# EAGLE schematic robotrev2 (EAGLE 7.1.0)
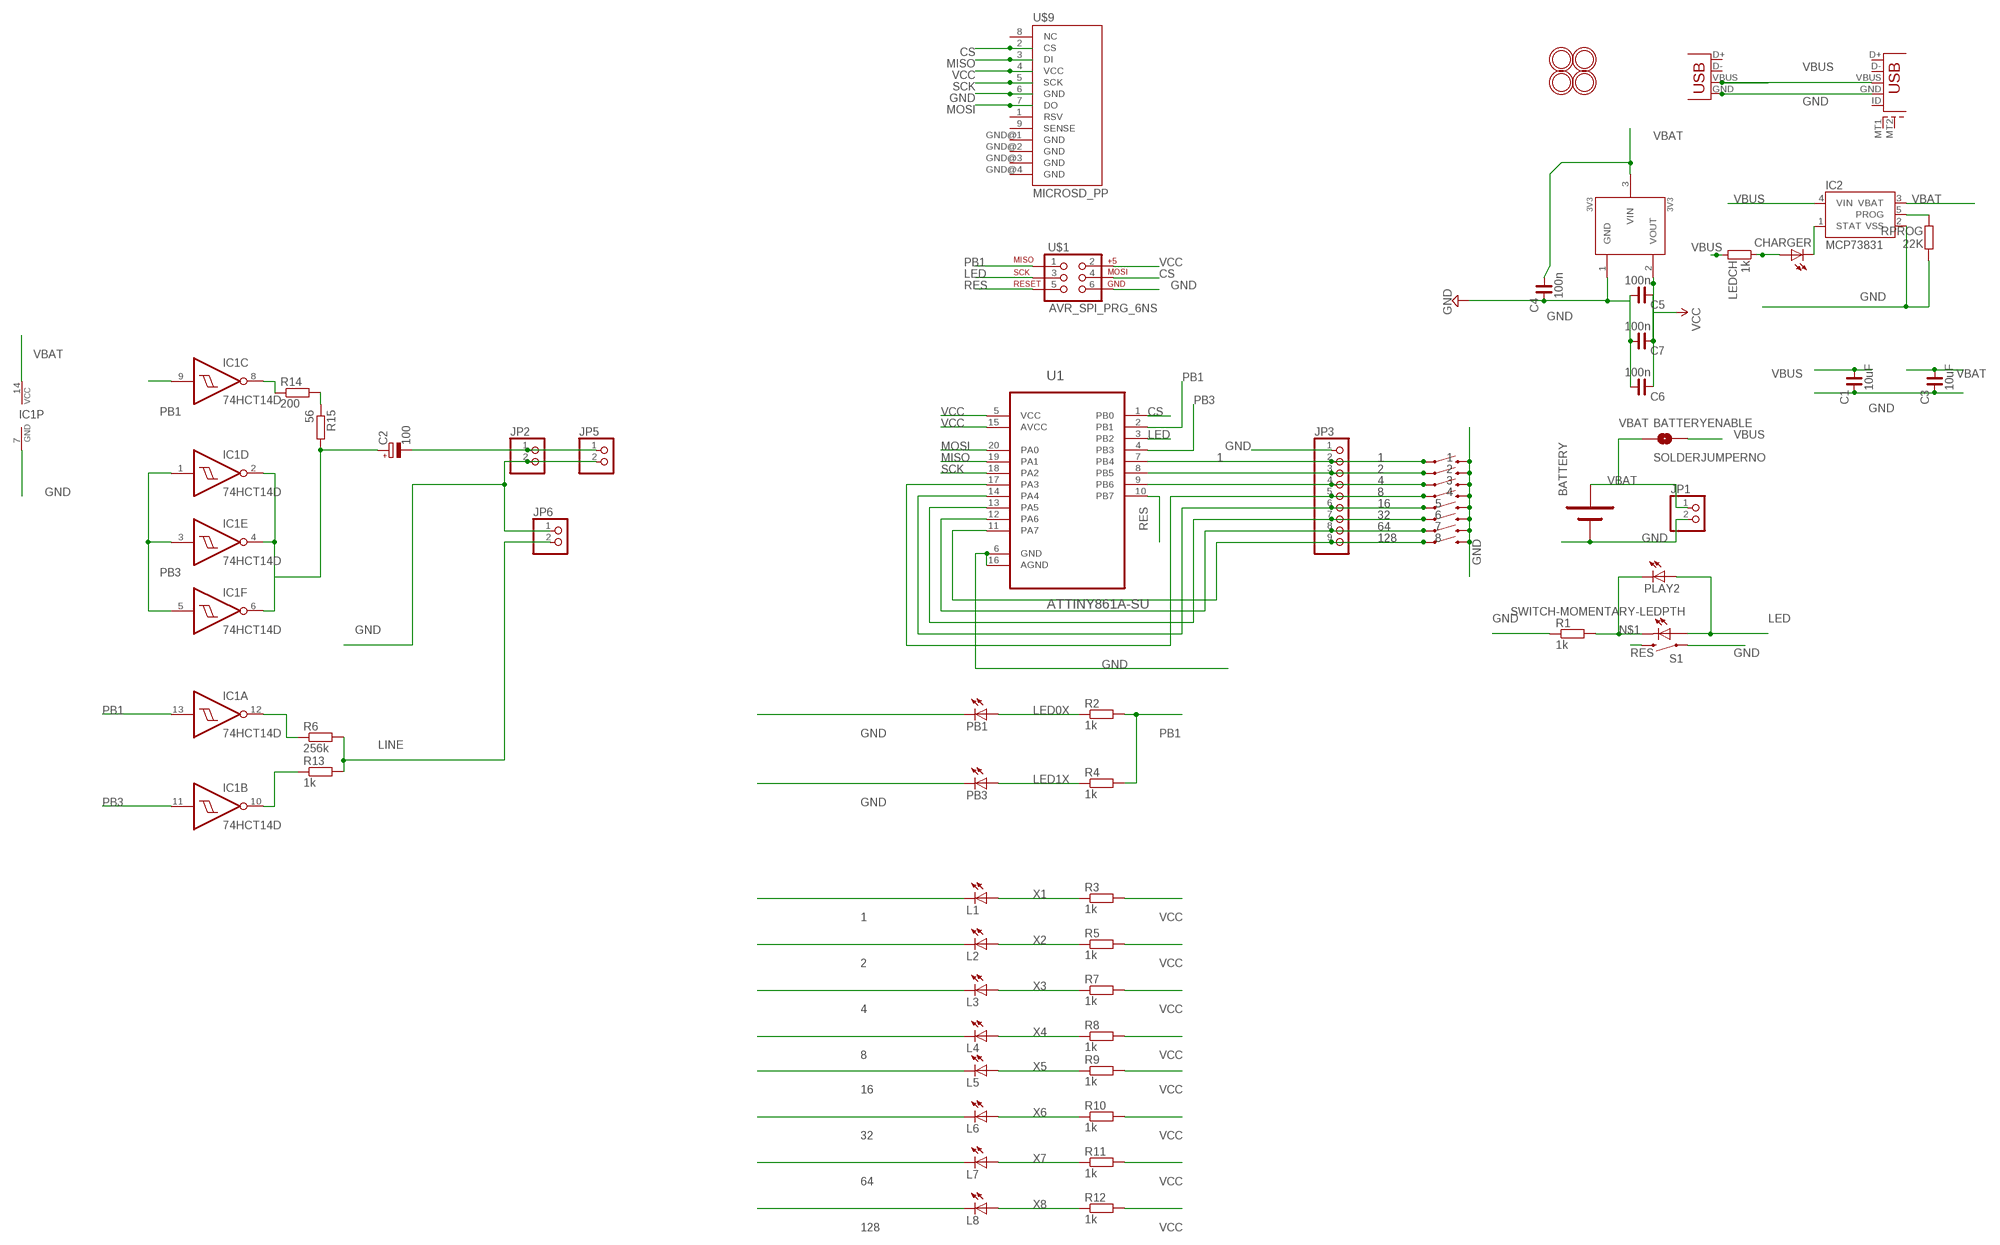
[diagram p0: schematic, sheet 1]

## Parts
1  SWITCH-MOMENTARY-2-SMD-1101NE  [TACTILE-SWITCH-1101NE]
2  SWITCH-MOMENTARY-2-SMD-1101NE  [TACTILE-SWITCH-1101NE]
3  SWITCH-MOMENTARY-2-SMD-1101NE  [TACTILE-SWITCH-1101NE]
3V3  3V3  MCP1700T  [SOT23]
4  SWITCH-MOMENTARY-2-SMD-1101NE  [TACTILE-SWITCH-1101NE]
5  SWITCH-MOMENTARY-2-SMD-1101NE  [TACTILE-SWITCH-1101NE]
6  SWITCH-MOMENTARY-2-SMD-1101NE  [TACTILE-SWITCH-1101NE]
7  SWITCH-MOMENTARY-2-SMD-1101NE  [TACTILE-SWITCH-1101NE]
8  SWITCH-MOMENTARY-2-SMD-1101NE  [TACTILE-SWITCH-1101NE]
BATTERY  BATTERY-1XAA20MM  [BATTCOM_20MM_PTH]
BATTERYENABLE  SOLDERJUMPERNO  [SJ_2S-NO]
C1  10uF  C_0603  [C0603]
C2  100  CPOL-EU153CLV-0605  [153CLV-0605]
C3  10uF  C_0603  [C0603]
C4  100n  C_0603  [C0603]
C5  100n  C_0603  [C0603]
C6  100n  C_0603  [C0603]
C7  100n  C_0603  [C0603]
CHARGER  LEDSML0603  [SML0603]
IC1  74HCT14D  [SO14]
IC2  MCP73831  [SOT23-5]
JP1  PINHD-1X2  [1X02]
JP2  PINHD-1X2  [1X02]
JP3  PINHD-1X9  [1X09]
JP5  PINHD-1X2  [1X02]
JP6  PINHD-1X2  [1X02]
L1  LEDSML0603  [SML0603]
L2  LEDSML0603  [SML0603]
L3  LEDSML0603  [SML0603]
L4  LEDSML0603  [SML0603]
L5  LEDSML0603  [SML0603]
L6  LEDSML0603  [SML0603]
L7  LEDSML0603  [SML0603]
L8  LEDSML0603  [SML0603]
LEDCH  1k  R-EU_R0603  [R0603]
PB1  LEDSML0603  [SML0603]
PB3  LEDSML0603  [SML0603]
PLAY2  LEDSML0603  [SML0603]
R1  1k  R-EU_R0603  [R0603]
R2  1k  R-EU_R0603  [R0603]
R3  1k  R-EU_R0603  [R0603]
R4  1k  R-EU_R0603  [R0603]
R5  1k  R-EU_R0603  [R0603]
R6  256k  R-EU_R0603  [R0603]
R7  1k  R-EU_R0603  [R0603]
R8  1k  R-EU_R0603  [R0603]
R9  1k  R-EU_R0603  [R0603]
R10  1k  R-EU_R0603  [R0603]
R11  1k  R-EU_R0603  [R0603]
R12  1k  R-EU_R0603  [R0603]
R13  1k  R-EU_R0603  [R0603]
R14  200  R-EU_R0603  [R0603]
R15  56  R-EU_R0603  [R0603]
RPROG  22K  R-EU_R0603  [R0603]
S1  SWITCH-MOMENTARY-LEDPTH  [TACTILE-PTH-LED-12MM]
U1  ATTINY861A-SU  [SOIC127P1032X265-20N]
U$1  AVR_SPI_PRG_6NS  [2X3-NS]
U$3  MOUNTINGHOLE2.0  [MOUNTINGHOLE_2.0_PLATED]
U$4  MOUNTINGHOLE2.0  [MOUNTINGHOLE_2.0_PLATED]
U$6  MOUNTINGHOLE2.0  [MOUNTINGHOLE_2.0_PLATED]
U$7  MOUNTINGHOLE2.0  [MOUNTINGHOLE_2.0_PLATED]
U$9  MICROSD_PP  [MICROSD_PP]
USB1  USB-MICROBLARGEPAD  [USB-MICROB_LARGEPAD]
X5  USBSMD  [USB-MINIB]

## Nets
1: 1.P$1 JP3.2 L1.C U1.7(PB4)
2: 2.P$1 JP3.3 L2.C U1.8(PB5)
4: 3.P$1 JP3.4 L3.C U1.9(PB6)
8: 4.P$1 JP3.5 L4.C U1.17(PA3)
16: 5.P$1 JP3.6 L5.C U1.14(PA4)
32: 6.P$1 JP3.7 L6.C U1.13(PA5)
64: 7.P$1 JP3.8 L7.C U1.12(PA6)
128: 8.P$1 JP3.9 L8.C U1.11(PA7)
CS: U1.1(PB0) U$1.4 U$9.2(CS)
GND: 1.P$2 2.P$2 3.P$2 3V3.1(GND) 4.P$2 5.P$2 6.P$2 7.P$2 8.P$2 BATTERY.- C1.2 C3.2 C4.2 C5.1 C6.1 C7.1 IC1.7(P:GND) IC2.2(VSS) JP1.2 JP2.2 JP3.1 JP5.2 JP6.1 PB1.C PB3.C R1.1 RPROG.1 S1.4 U1.6(GND) U1.16(AGND) U$1.6 U$9.6(GND) USB1.GND X5.GND
LED: PLAY2.A S1.A U1.3(PB2) U$1.3
LED0X: PB1.A R2.1
LED1X: PB3.A R4.1
LINE: JP6.2 R6.2 R13.2
MISO: U1.19(PA1) U$9.3(DI)
MOSI: U1.20(PA0) U$9.7(DO)
N$1: PLAY2.C R1.2 S1.C
N$12: IC1.8(C:O) R14.1
N$13: C2.+ IC1.2(D:O) IC1.4(E:O) IC1.6(F:O) R15.2
N$14: C2.- JP2.1 JP5.1
N$15: IC1.12(A:O) R6.1
N$16: IC1.10(B:O) R13.1
N$17: R14.2 R15.1
N$18: CHARGER.C IC2.1(STAT)
N$31: IC2.5(PROG) RPROG.2
N$35: CHARGER.A LEDCH.1
PB1: IC1.9(C:I) IC1.13(A:I) R2.2 R4.2 U1.2(PB1) U$1.1
PB3: IC1.1(D:I) IC1.3(E:I) IC1.5(F:I) IC1.11(B:I) U1.4(PB3)
RES: S1.2 U1.10(PB7) U$1.5
SCK: U1.18(PA2) U$9.5(SCK)
VBAT: 3V3.3(VIN) BATTERY.+ BATTERYENABLE.1 C3.1 C4.1 IC1.14(P:VCC) IC2.3(VBAT) JP1.1
VBUS: BATTERYENABLE.2 C1.1 IC2.4(VIN) LEDCH.2 USB1.VBUS X5.VBUS
VCC: 3V3.2(VOUT) C5.2 C6.2 C7.2 R3.2 R5.2 R7.2 R8.2 R9.2 R10.2 R11.2 R12.2 U1.5(VCC) U1.15(AVCC) U$1.2 U$9.4(VCC)
X1: L1.A R3.1
X2: L2.A R5.1
X3: L3.A R7.1
X4: L4.A R8.1
X5: L5.A R9.1
X6: L6.A R10.1
X7: L7.A R11.1
X8: L8.A R12.1
Unconnected: U$9.1(RSV) U$9.8(NC) U$9.9(SENSE) U$9.GND@1(GND) U$9.GND@2(GND) U$9.GND@3(GND) U$9.GND@4(GND) USB1.D+ USB1.D- USB1.ID USB1.MT1(SHEILD1) USB1.MT2(SHEILD2) X5.D+ X5.D-

## Library data of the parts
1-8 = SparkFun:SWITCH-MOMENTARY-2
3V3 = okie:MCP1700T
BATTERY = es:BATTERY-1XAA
BATTERYENABLE = SparkFun:SOLDERJUMPER: Solder Jumper Standard SMD solder jumper. Used to automate production. Two varients : Normally Open and Normally Closed are the same, but have different paste layers. NC will have a large amount of paste and should jumper during reflow.
C1 C3-C7 = rc-master-smd:C_: NON-POLARIZED CAP
C2 = resistor:CPOL-EU: POLARIZED CAPACITOR, European symbol
CHARGER L1-L8 PB1 PB3 PLAY2 = led:LED: LED OSRAM: - CHIPLED LG R971, LG N971, LY N971, LG Q971, LY Q971, LO R971, LY R971 LH N974, LH R974 LS Q976, LO Q976, LY Q976 LO Q996 - Hyper CHIPLED LW Q18S LB Q993, LB Q99A, LB R99A - SideLED LS A670, LO A670, LY A670, LG A670, LP A670 LB A673, LV A673, LT A673, LW A673 LH A674 LY A675 LS A676, LA A676, LO A676, LY A676, LW A676 LS A679, LY A679, LG A679 - Hyper Micro SIDELED® LS Y876, LA Y876, LO Y876, LY Y876 LT Y87S - SmartLED LW L88C, LW L88S LB L89C, LB L89S, LG L890 LS L89K, LO L89K, LY L89K LS L896, LA L896, LO L896, LY L896 - TOPLED LS T670, LO T670, LY T670, LG T670, LP T670 LSG T670, LSP T670, LSY T670, LOP T670, LYG T670 LG T671, LOG T671, LSG T671 LB T673, LV T673, LT T673, LW T673 LH T674 LS T676, LA T676, LO T676, LY T676, LB T676, LH T676, LSB T676, LW T676 LB T67C, LV T67C, LT T67C, LS T67K, LO T67K, LY T67K, LW E67C LS E67B, LA E67B, LO E67B, LY E67B, LB E67C, LV E67C, LT E67C LW T67C LS T679, LY T679, LG T679 LS T770, LO T770, LY T770, LG T770, LP T770 LB T773, LV T773, LT T773, LW T773 LH T774 LS E675, LA E675, LY E675, LS T675 LS T776, LA T776, LO T776, LY T776, LB T776 LHGB T686 LT T68C, LB T68C - Hyper Mini TOPLED® LB M676 - Mini TOPLED Santana® LG M470 LS M47K, LO M47K, LY M47K Source: http://www.osram.convergy.de LUXEON: - LUMILED® LXK2-PW12-R00, LXK2-PW12-S00, LXK2-PW14-U00, LXK2-PW14-V00 LXK2-PM12-R00, LXK2-PM12-S00, LXK2-PM14-U00 LXK2-PE12-Q00, LXK2-PE12-R00, LXK2-PE12-S00, LXK2-PE14-T00, LXK2-PE14-U00 LXK2-PB12-K00, LXK2-PB12-L00, LXK2-PB12-M00, LXK2-PB14-N00, LXK2-PB14-P00, LXK2-PB14-Q00 LXK2-PR12-L00, LXK2-PR12-M00, LXK2-PR14-Q00, LXK2-PR14-R00 LXK2-PD12-Q00, LXK2-PD12-R00, LXK2-PD12-S00 LXK2-PH12-R00, LXK2-PH12-S00 LXK2-PL12-P00, LXK2-PL12-Q00, LXK2-PL12-R00 Source: www.luxeon.com KINGBRIGHT: KA-3528ASYC Source: www.kingbright.com
IC1 = 74xx-eu:74*14: Hex schmitt trigger INVERTER
IC2 = SparkFunNew:MCP73831: Microchip's MCP73831 Miniature single cell, fully integrated Li-Ion, Li-polymer charge management controller http://ww1.microchip.com/downloads/en/DeviceDoc/21984a.pdf
JP1 JP2 JP5 JP6 = pinhead:PINHD-1X2: PIN HEADER
JP3 = pinhead:PINHD-1X9: PIN HEADER
LEDCH RPROG = rcl:R-EU_: RESISTOR, European symbol
R1-R15 = resistor:R-EU_: RESISTOR, European symbol
S1 = Local Library:SWITCH-MOMENTARY-LED
U1 = Atmel_By_element14_Batch_1-00:ATTINY861A-SU: 8-bit Microcontroller with In-System Programmable Flash; MPN: ATTINY861A-SU; OC_FARNELL: 1841628; OC_NEWARK: 12T1344; PACKAGE: SOIC-20; SUPPLIER: Atmel
U$1 = SparkFun:AVR_SPI_PRG_6: AVR ISP 6 Pin This is the reduced ISP connector for AVR programming. Common on Arduino. This footprint will take up less PCB space and can be used with a 10-pin to 6-pin adapter such as SKU: BOB-08508
U$3 U$4 U$6 U$7 = microbuilder:MOUNTINGHOLE: Mounting Hole
U$9 = DE1594-v2:MICROSD_PP
USB1 = zak:USB-MICROB
X5 = SparkFun:USB: USB Connectors USB-B-PTH is fully proven SKU : PRT-00139 USB-miniB is fully proven SKU : PRT-00587 USB-A-PCB is untested. USB-A-H is throughly reviewed, but untested. Spark Fun Electronics SKU : PRT-00437 USB-B-SMT is throughly reviewed, but untested. Needs silkscreen touching up. USB-A-S has not been used/tested USB-MB-H has not been used/tested

## Net classes
0 default: width 0.229 mm, drill 0.381 mm, clearance 0.229 mm
1 GND: width 0.229 mm, drill 0.381 mm, clearance 0.229 mm
2 pwr: width 0.229 mm, drill 0.381 mm, clearance 0.229 mm